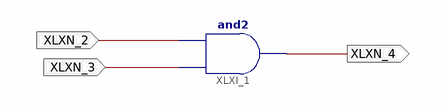
[diagram p0: schematic sheet 1]
// Xilinx ISE schematic testAND2.sch (artix7) as structural Verilog: 1 symbols, 3 ports
module testAND2 (
  input  XLXN_2,
  input  XLXN_3,
  output XLXN_4
);

  and XLXI_1 (XLXN_4, XLXN_3, XLXN_2);
endmodule
